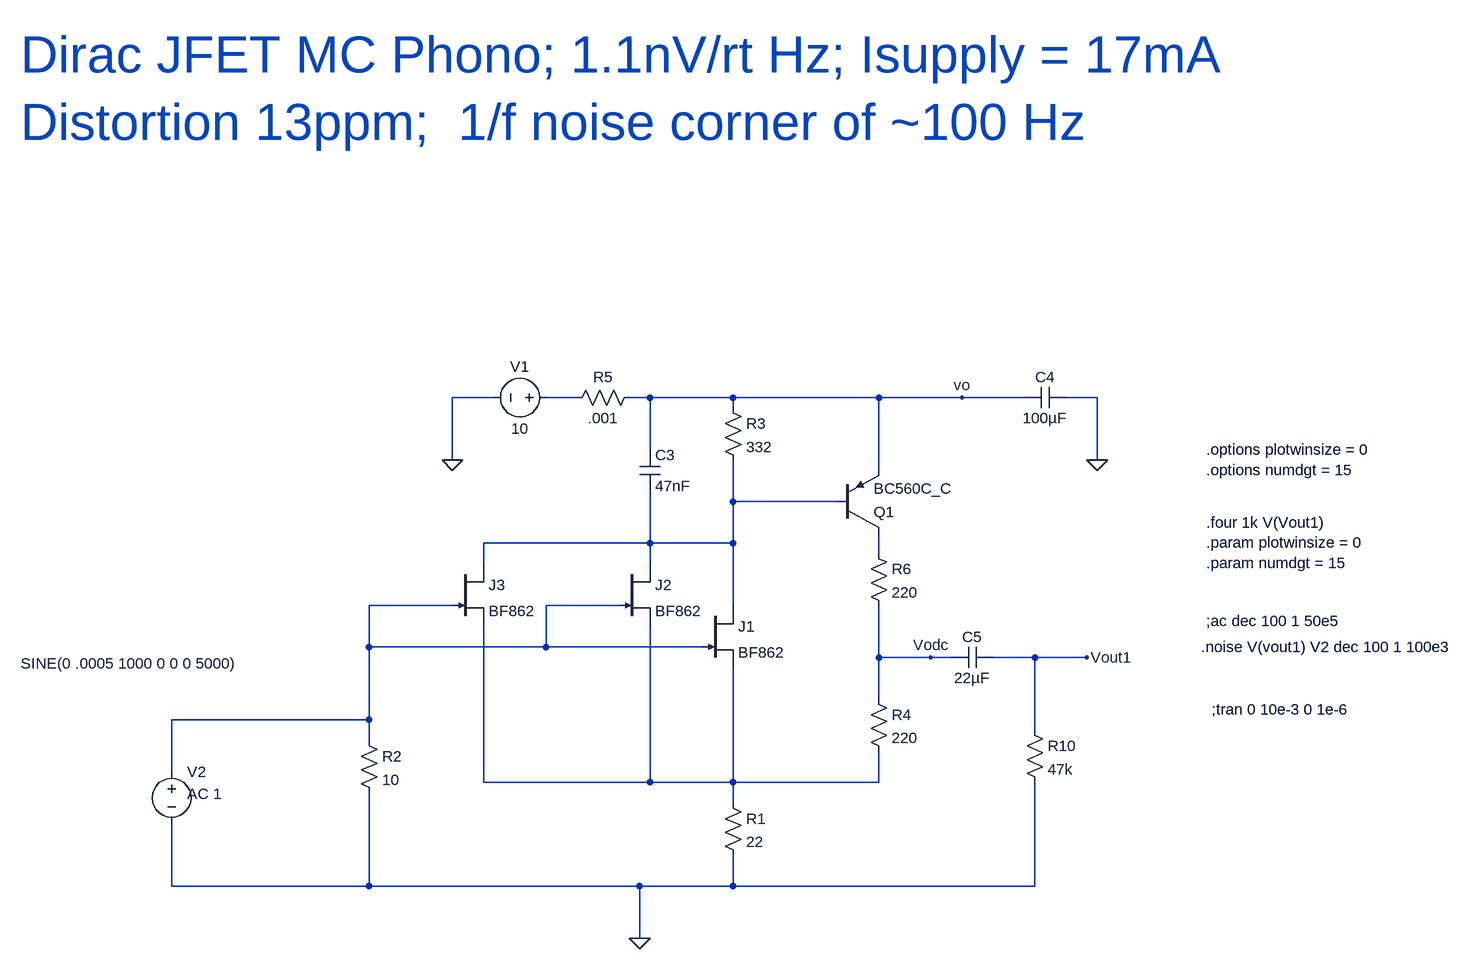
[diagram p0: schematic Dirac.asc]
Dirac.asc, the LTspice schematic file:
Version 4
SHEET 1 1960 680
WIRE 240 -384 176 -384
WIRE 368 -384 320 -384
WIRE 480 -384 448 -384
WIRE 608 -384 480 -384
WIRE 832 -384 608 -384
WIRE 960 -384 832 -384
WIRE 1056 -384 960 -384
WIRE 1168 -384 1120 -384
WIRE 608 -368 608 -384
WIRE 480 -304 480 -384
WIRE 176 -288 176 -384
WIRE 1168 -288 1168 -384
WIRE 832 -272 832 -384
WIRE 608 -224 608 -288
WIRE 768 -224 608 -224
WIRE 480 -160 480 -240
WIRE 480 -160 224 -160
WIRE 608 -160 608 -224
WIRE 608 -160 480 -160
WIRE 832 -144 832 -176
WIRE 224 -128 224 -160
WIRE 480 -128 480 -160
WIRE 176 -64 48 -64
WIRE 432 -64 320 -64
WIRE 608 -64 608 -160
WIRE 48 0 48 -64
WIRE 320 0 320 -64
WIRE 320 0 48 0
WIRE 560 0 320 0
WIRE 832 16 832 -64
WIRE 912 16 832 16
WIRE 944 16 912 16
WIRE 1072 16 1008 16
WIRE 1152 16 1072 16
WIRE 832 80 832 16
WIRE 48 112 48 0
WIRE 48 112 -256 112
WIRE 1072 128 1072 16
WIRE 48 144 48 112
WIRE -256 192 -256 112
WIRE 224 208 224 -32
WIRE 480 208 480 -32
WIRE 480 208 224 208
WIRE 608 208 608 32
WIRE 608 208 480 208
WIRE 832 208 832 160
WIRE 832 208 608 208
WIRE 608 240 608 208
WIRE -256 368 -256 272
WIRE 48 368 48 224
WIRE 48 368 -256 368
WIRE 464 368 48 368
WIRE 608 368 608 320
WIRE 608 368 464 368
WIRE 1072 368 1072 208
WIRE 1072 368 608 368
WIRE 464 448 464 368
FLAG 464 448 0
FLAG 176 -288 0
FLAG 1168 -288 0
FLAG 1152 16 Vout1
FLAG 912 16 Vodc
FLAG 960 -384 vo
SYMBOL njf 560 -64 R0
SYMATTR InstName J1
SYMATTR Value BF862
SYMBOL res 592 224 R0
SYMATTR InstName R1
SYMATTR Value 22
SYMBOL res 592 -384 R0
SYMATTR InstName R3
SYMATTR Value 332
SYMBOL voltage 336 -384 R90
WINDOW 0 -32 56 VBottom 2
WINDOW 3 32 56 VTop 2
WINDOW 123 2 56 VBottom 2
WINDOW 39 0 0 Left 2
SYMATTR InstName V1
SYMATTR Value 10
SYMBOL voltage -256 176 R0
WINDOW 3 -232 -151 Left 2
WINDOW 123 24 50 Left 2
WINDOW 39 52 66 Left 2
SYMATTR Value SINE(0 .0005 1000 0 0 0 5000)
SYMATTR Value2 AC 1
SYMATTR InstName V2
SYMBOL cap 1120 -400 R90
WINDOW 0 0 32 VBottom 2
WINDOW 3 32 32 VTop 2
SYMATTR InstName C4
SYMATTR Value 100µF
SYMBOL pnp 768 -176 M180
SYMATTR InstName Q1
SYMATTR Value BC560C_C
SYMBOL res 32 128 R0
SYMATTR InstName R2
SYMATTR Value 10
SYMBOL res 816 64 R0
SYMATTR InstName R4
SYMATTR Value 220
SYMBOL cap 464 -304 R0
SYMATTR InstName C3
SYMATTR Value 47nF
SYMBOL cap 1008 0 R90
WINDOW 0 0 32 VBottom 2
WINDOW 3 32 32 VTop 2
SYMATTR InstName C5
SYMATTR Value 22µF
SYMBOL res 1056 112 R0
SYMATTR InstName R10
SYMATTR Value 47k
SYMBOL njf 432 -128 R0
SYMATTR InstName J2
SYMATTR Value BF862
SYMBOL njf 176 -128 R0
SYMATTR InstName J3
SYMATTR Value BF862
SYMBOL res 464 -400 R90
WINDOW 0 0 56 VBottom 2
WINDOW 3 32 56 VTop 2
SYMATTR InstName R5
SYMATTR Value .001
SYMBOL res 816 -160 R0
SYMATTR InstName R6
SYMATTR Value 220
TEXT 1336 -40 Left 2 !;ac dec 100 1 50e5
TEXT 1344 96 Left 2 !;tran 0 10e-3 0 1e-6
TEXT 1328 0 Left 2 !.noise V(vout1) V2 dec 100 1 100e3
TEXT 1336 -192 Left 2 !.four 1k V(Vout1)\n.param plotwinsize = 0\n.param numdgt = 15
TEXT 1336 -304 Left 2 !.options plotwinsize = 0\n.options numdgt = 15
TEXT -488 -912 Left 6 ;Dirac JFET MC Phono; 1.1nV/rt Hz; Isupply = 17mA\nDistortion 13ppm;  1/f noise corner of ~100 Hz

The netlist it stands for:
* Dirac.asc
J1 N002 N004 N005 BF862
R1 N005 0 22
R3 vo N002 332
V1 N001 0 10
V2 N004 0 SINE(0 .0005 1000 0 0 0 5000) AC 1
C4 0 vo 100µF
Q1 N003 N002 vo 0 BC560C_C
R2 N004 0 10
R4 Vodc N005 220
C3 vo N002 47nF
C5 Vout1 Vodc 22µF
R10 Vout1 0 47k
J2 N002 N004 N005 BF862
J3 N002 N004 N005 BF862
R5 vo N001 .001
R6 N003 Vodc 220
.model NPN NPN
.model PNP PNP
.lib standard.bjt
.model NJF NJF
.model PJF PJF
.lib standard.jft
;ac dec 100 1 50e5
;tran 0 10e-3 0 1e-6
.noise V(vout1) V2 dec 100 1 100e3
.four 1k V(Vout1)
.param plotwinsize = 0
.param numdgt = 15
.options plotwinsize = 0
.options numdgt = 15
* Dirac JFET MC Phono; 1.1nV/rt Hz; Isupply = 17mA
* Distortion 13ppm;  1/f noise corner of ~100 Hz
.backanno
.end